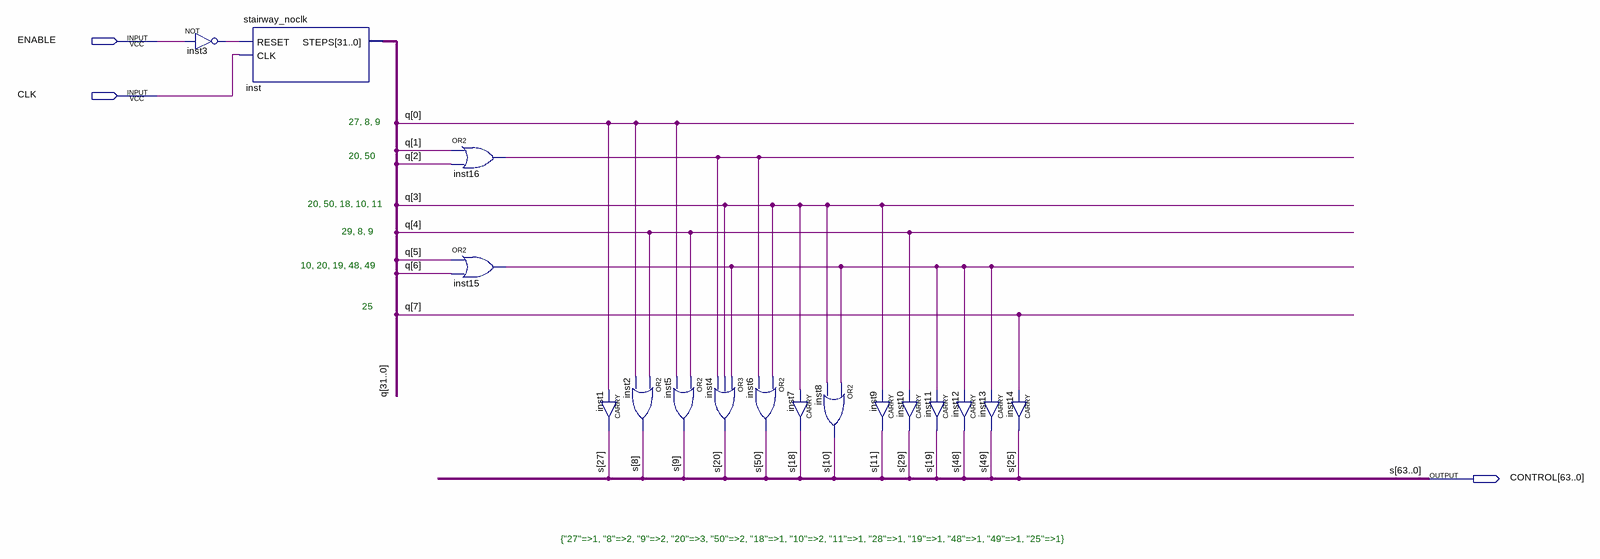
[diagram p0: schematic sheet]
// Quartus schematic macro_mov_adr_reg.bdf as structural Verilog: 17 symbols, 3 pins
module macro_mov_adr_reg (
  input  ENABLE,
  input  CLK,
  output [63:0] CONTROL
);

  wire inst3_out, inst15_out, inst16_out;
  wire [31:0] q;

  not inst3 (inst3_out, ENABLE);
  stairway_noclk inst (.RESET(inst3_out), .CLK(CLK), .STEPS(q));
  or inst16 (inst16_out, q[1], q[2]);
  or inst15 (inst15_out, q[5], q[6]);
  or inst2 (CONTROL[8], q[4], q[0]);
  CARRY inst1 (.IN(q[0]), .OUT(CONTROL[27]));
  or inst5 (CONTROL[9], q[4], q[0]);
  or inst4 (CONTROL[20], inst15_out, q[3], inst16_out);
  or inst6 (CONTROL[50], q[3], inst16_out);
  CARRY inst7 (.IN(q[3]), .OUT(CONTROL[18]));
  or inst8 (CONTROL[10], inst15_out, q[3]);
  CARRY inst9 (.IN(q[3]), .OUT(CONTROL[11]));
  CARRY inst10 (.IN(q[4]), .OUT(CONTROL[29]));
  CARRY inst11 (.IN(inst15_out), .OUT(CONTROL[19]));
  CARRY inst12 (.IN(inst15_out), .OUT(CONTROL[48]));
  CARRY inst13 (.IN(inst15_out), .OUT(CONTROL[49]));
  CARRY inst14 (.IN(q[7]), .OUT(CONTROL[25]));

  // Other names for the same wires on the sheet: s[63:0] = CONTROL

  // Notes on the sheet:
  //   27, 8, 9
  //   20, 50
  //   20, 50, 18, 10, 11
  //   29, 8, 9
  //   10, 20, 19, 48, 49
  //   25
  //   {"27"=>1, "8"=>2, "9"=>2, "20"=>3, "50"=>2, "18"=>1, "10"=>2, "11"=>1, "28"=>1, "19"=>1, "48"=>1, "49"=>1, "25"=>1}
endmodule
